# EAGLE schematic ledrampsesquema (EAGLE 7.6.0)
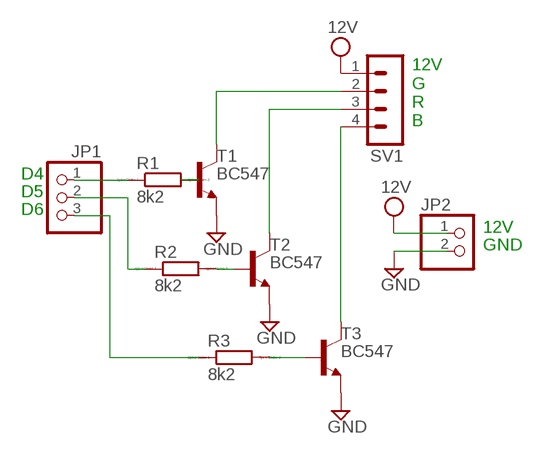
[diagram p0: schematic, sheet 1]

## Parts
JP1  PINHD-1X3  [1X03]
JP2  PINHD-1X2  [1X02]
R1  8k2  R0204/7  [0204/7]
R2  8k2  R0204/7  [0204/7]
R3  8k2  R0204/7  [0204/7]
SV1  MA04-1  [MA04-1]
T1  BC547  [TO92]
T2  BC547  [TO92]
T3  BC547  [TO92]

## Nets
GND: JP2.2 T1.1(E) T2.1(E) T3.1(E)
N$1: R1.2 T1.2(B)
N$2: JP1.1 R1.1
N$3: SV1.2 T1.3(C)
N$4: SV1.3 T2.3(C)
N$5: SV1.4 T3.3(C)
N$6: R2.2 T2.2(B)
N$7: R3.2 T3.2(B)
N$8: JP1.2 R2.1
N$9: JP1.3 R3.1
VCC: JP2.1 SV1.1 ; supply symbol labelled 12V

## Notes on the sheet
- 12V
  G
  R
  B
- D4
- D5
- D6
- 12V
- GND

## Library data of the parts
JP1 = pinhead:PINHD-1X3: PIN HEADER
JP2 = pinhead:PINHD-1X2: PIN HEADER
R1-R3 = eagle-ltspice:R: RESISTOR, European symbol; SPICEMODEL: NONE; SPICEPREFIX: R
SV1 = con-lstb:MA04-1: PIN HEADER; OC_FARNELL: unknown; OC_NEWARK: unknown
T1-T3 = transistor:BC547: NPN TRANSISTOR